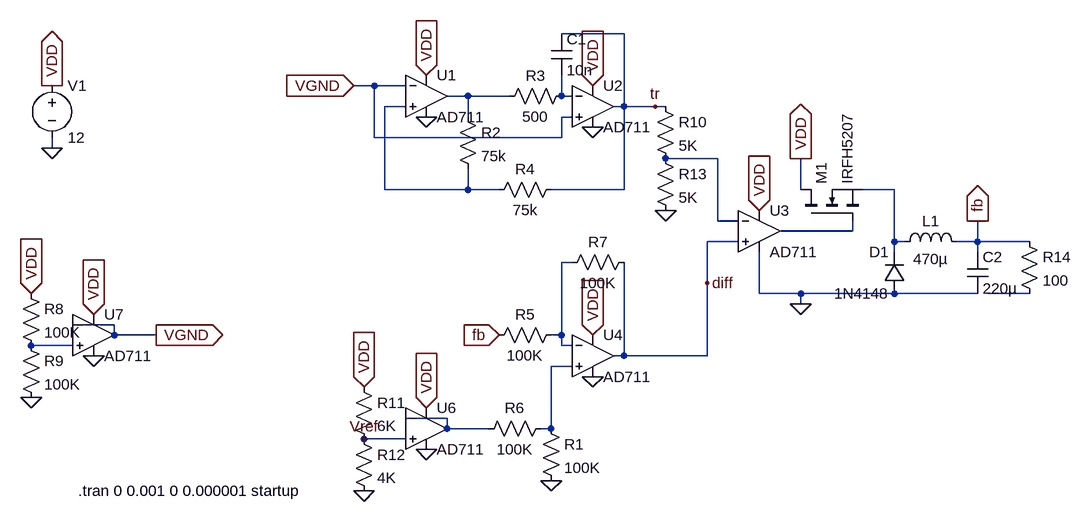
[diagram p0: schematic buck.asc]
buck.asc, the LTspice schematic file:
Version 4
SHEET 1 1672 740
WIRE 496 -48 400 -48
WIRE 112 32 80 32
WIRE 160 32 112 32
WIRE 256 48 224 48
WIRE 320 48 256 48
WIRE 400 48 400 16
WIRE 416 48 400 48
WIRE 160 64 128 64
WIRE 496 64 496 -48
WIRE 496 64 480 64
WIRE 544 64 496 64
WIRE 560 64 544 64
WIRE 256 80 256 48
WIRE 416 80 400 80
WIRE 112 112 112 32
WIRE 400 112 400 80
WIRE 400 112 112 112
WIRE -384 128 -384 112
WIRE 640 144 560 144
WIRE 128 192 128 64
WIRE 256 192 256 160
WIRE 256 192 128 192
WIRE 304 192 256 192
WIRE 496 192 496 64
WIRE 496 192 384 192
WIRE 768 192 768 144
WIRE 912 192 864 192
WIRE 640 240 640 144
WIRE 672 240 640 240
WIRE 848 256 848 240
WIRE 848 256 736 256
WIRE 672 272 624 272
WIRE 912 272 912 192
WIRE 928 272 912 272
WIRE 1040 272 1040 240
WIRE 1040 272 1008 272
WIRE 1120 272 1040 272
WIRE 912 288 912 272
WIRE 1040 288 1040 272
WIRE 416 304 400 304
WIRE 624 336 624 272
WIRE 704 352 704 288
WIRE 768 352 704 352
WIRE 912 352 768 352
WIRE 1040 352 912 352
WIRE 1120 352 1056 352
WIRE 768 368 768 352
WIRE -288 400 -352 400
WIRE -288 416 -288 400
WIRE -224 416 -288 416
WIRE 400 416 400 304
WIRE 400 416 384 416
WIRE -352 432 -416 432
WIRE 400 432 400 416
WIRE 416 432 400 432
WIRE 496 448 496 304
WIRE 496 448 480 448
WIRE 624 448 624 336
WIRE 624 448 496 448
WIRE 416 464 384 464
WIRE 224 544 160 544
WIRE 224 560 224 544
WIRE 288 560 224 560
WIRE 384 560 384 464
WIRE 384 560 368 560
WIRE 160 576 96 576
FLAG -384 32 VDD
IOPIN -384 32 Out
FLAG 192 16 VDD
IOPIN 192 16 In
FLAG 448 32 VDD
IOPIN 448 32 In
FLAG 704 224 VDD
IOPIN 704 224 In
FLAG 448 416 VDD
IOPIN 448 416 In
FLAG -320 384 VDD
IOPIN -320 384 In
FLAG -416 352 VDD
IOPIN -416 352 In
FLAG 192 528 VDD
IOPIN 192 528 In
FLAG 96 496 VDD
IOPIN 96 496 In
FLAG 96 656 0
FLAG -384 128 0
FLAG -320 448 0
FLAG -416 512 0
FLAG 192 80 0
FLAG 448 96 0
FLAG 448 480 0
FLAG 192 592 0
FLAG -224 416 VGND
IOPIN -224 416 Out
FLAG 80 32 VGND
IOPIN 80 32 In
FLAG 768 368 0
FLAG 768 144 VDD
IOPIN 768 144 Out
FLAG 1040 240 fb
IOPIN 1040 240 Out
FLAG 304 416 fb
IOPIN 304 416 In
FLAG 544 64 tr
FLAG 624 336 diff
FLAG 96 576 Vref
FLAG 384 640 0
FLAG 560 224 0
SYMBOL voltage -384 16 R0
WINDOW 123 0 0 Left 0
WINDOW 39 0 0 Left 0
SYMATTR InstName V1
SYMATTR Value 12
SYMBOL res 368 544 R0
SYMATTR InstName R1
SYMATTR Value 100K
SYMBOL res 240 64 R0
SYMATTR InstName R2
SYMATTR Value 75k
SYMBOL res 416 32 R90
WINDOW 0 0 56 VBottom 2
WINDOW 3 32 56 VTop 2
SYMATTR InstName R3
SYMATTR Value 500
SYMBOL res 400 176 R90
WINDOW 0 0 56 VBottom 2
WINDOW 3 32 56 VTop 2
SYMATTR InstName R4
SYMATTR Value 75k
SYMBOL res 400 400 R90
WINDOW 0 0 56 VBottom 2
WINDOW 3 32 56 VTop 2
SYMATTR InstName R5
SYMATTR Value 100K
SYMBOL res 384 544 R90
WINDOW 0 0 56 VBottom 2
WINDOW 3 32 56 VTop 2
SYMATTR InstName R6
SYMATTR Value 100K
SYMBOL res 512 288 R90
WINDOW 0 0 56 VBottom 2
WINDOW 3 32 56 VTop 2
SYMATTR InstName R7
SYMATTR Value 100K
SYMBOL cap 384 -48 R0
SYMATTR InstName C1
SYMATTR Value 10n
SYMBOL res -432 336 R0
SYMATTR InstName R8
SYMATTR Value 100K
SYMBOL res -432 416 R0
SYMATTR InstName R9
SYMATTR Value 100K
SYMBOL res 80 480 R0
SYMATTR InstName R11
SYMATTR Value 6K
SYMBOL res 80 560 R0
SYMATTR InstName R12
SYMATTR Value 4K
SYMBOL cap 1024 288 R0
SYMATTR InstName C2
SYMATTR Value 220µ
SYMBOL ind 912 288 R270
WINDOW 0 32 56 VTop 2
WINDOW 3 5 56 VBottom 2
SYMATTR InstName L1
SYMATTR Value 470µ
SYMBOL diode 928 352 R180
WINDOW 0 24 64 Left 2
WINDOW 3 24 0 Left 2
SYMATTR InstName D1
SYMATTR Value 1N4148
SYMBOL OpAmps\\AD711 192 -16 R0
SYMATTR InstName U1
SYMBOL OpAmps\\AD711 448 0 R0
SYMATTR InstName U2
SYMBOL OpAmps\\AD711 704 192 R0
SYMATTR InstName U3
SYMBOL OpAmps\\AD711 192 496 R0
SYMATTR InstName U6
SYMBOL OpAmps\\AD711 -320 352 R0
SYMATTR InstName U7
SYMBOL nmos 768 240 R270
SYMATTR InstName M1
SYMATTR Value IRFH5207
SYMBOL OpAmps\\AD711 448 384 R0
SYMATTR InstName U4
SYMBOL res 544 48 R0
SYMATTR InstName R10
SYMATTR Value 5K
SYMBOL res 544 128 R0
SYMATTR InstName R13
SYMATTR Value 5K
SYMBOL res 1104 256 R0
SYMATTR InstName R14
SYMATTR Value 100
TEXT -344 656 Left 2 !.tran 0 0.001 0 0.000001 startup

The netlist it stands for:
* buck.asc
V1 VDD 0 12
R1 N010 0 100K
R2 N001 N003 75k
R3 N002 N001 500
R4 tr N003 75k
R5 N007 fb 100K
R6 N010 N011 100K
R7 diff N007 100K
C1 tr N002 10n
R8 VDD N009 100K
R9 N009 0 100K
R11 VDD Vref 6K
R12 Vref 0 4K
C2 fb 0 220µ
L1 N005 fb 470µ
D1 0 N005 1N4148
XU1 N003 VGND VDD 0 N001 AD712  ; AD711, pins In+ In- V+ V- OUT
XU2 VGND N002 VDD 0 tr AD712  ; AD711, pins In+ In- V+ V- OUT
XU3 diff N004 VDD 0 N006 AD712  ; AD711, pins In+ In- V+ V- OUT
XU6 Vref N011 VDD 0 N011 AD712  ; AD711, pins In+ In- V+ V- OUT
XU7 N009 VGND VDD 0 VGND AD712  ; AD711, pins In+ In- V+ V- OUT
M1 VDD N006 N005 N005 IRFH5207
XU4 N010 N007 VDD 0 diff AD712  ; AD711, pins In+ In- V+ V- OUT
R10 tr N004 5K
R13 N004 0 5K
R14 fb N008 100
.model D D
.lib standard.dio
.model NMOS NMOS
.model PMOS PMOS
.lib standard.mos
.tran 0 0.001 0 0.000001 startup
.lib ADI1.lib
.backanno
.end

* Results of the author's LTspice run, read from the files saved beside the schematic
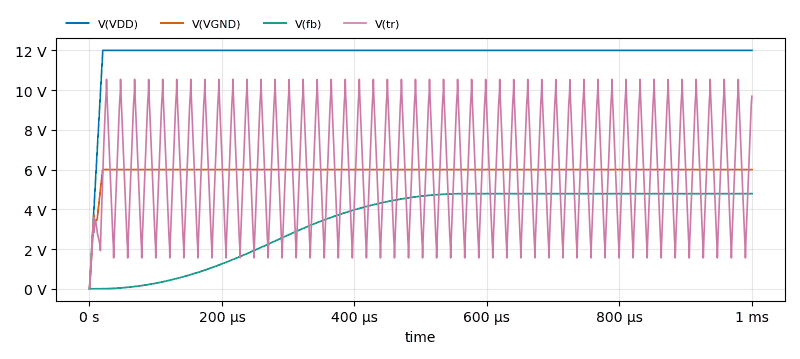
[diagram p1: Transient Analysis of buck.asc, plotted from the saved traces]
* Transient Analysis, 1 run:
*   V(VDD): min 0 V, max 12 V, average 11.88 V, rms 11.92 V, last 12 V
*   V(VGND): min 0 V, max 6.009 V, average 5.949 V, rms 5.963 V, last 6 V
*   V(fb): min 0 V, max 4.789 V, average 3.443 V, rms 3.87 V, last 4.789 V
*   V(tr): min 0 V, max 10.54 V, average 6.02 V, rms 6.536 V, last 9.692 V